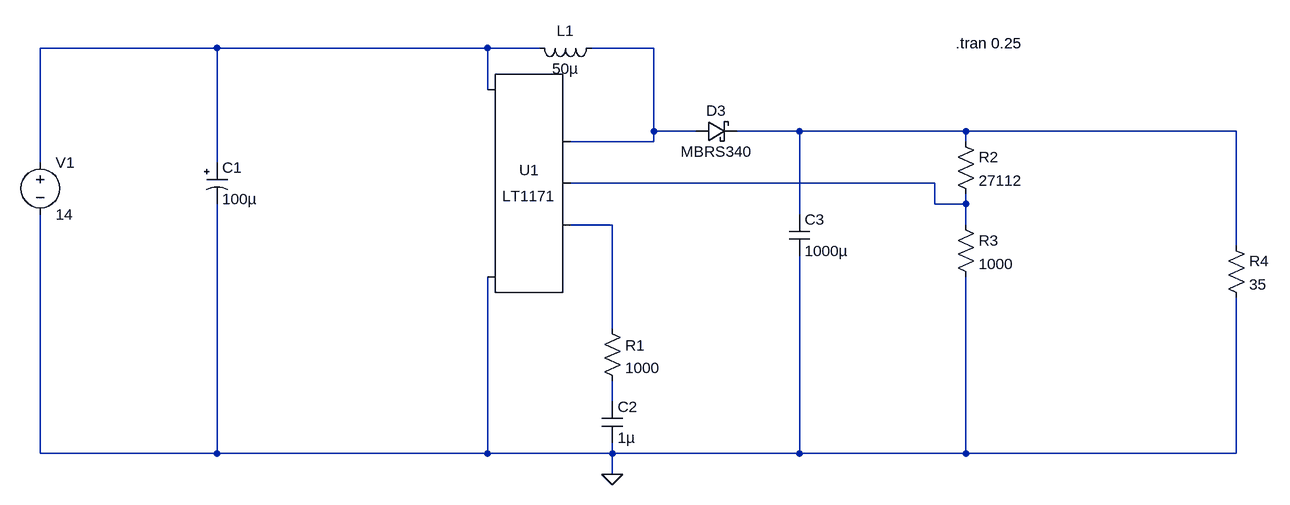
[diagram p0: schematic Simu boost.asc]
Simu boost.asc, the LTspice schematic file:
Version 4
SHEET 1 1396 680
WIRE -240 -16 -512 -16
WIRE 176 -16 -240 -16
WIRE 256 -16 176 -16
WIRE 432 -16 336 -16
WIRE 176 48 176 -16
WIRE 432 112 432 -16
WIRE 496 112 432 112
WIRE 656 112 560 112
WIRE 912 112 656 112
WIRE 1328 112 912 112
WIRE 432 128 432 112
WIRE 432 128 304 128
WIRE 912 128 912 112
WIRE -512 160 -512 -16
WIRE -240 160 -240 -16
WIRE 864 192 304 192
WIRE 864 224 864 192
WIRE 912 224 912 208
WIRE 912 224 864 224
WIRE 656 240 656 112
WIRE 368 256 304 256
WIRE 912 256 912 224
WIRE 1328 288 1328 112
WIRE 368 416 368 256
WIRE 368 528 368 496
WIRE -512 608 -512 240
WIRE -240 608 -240 224
WIRE -240 608 -512 608
WIRE 176 608 176 336
WIRE 176 608 -240 608
WIRE 368 608 368 592
WIRE 368 608 176 608
WIRE 656 608 656 304
WIRE 656 608 368 608
WIRE 912 608 912 336
WIRE 912 608 656 608
WIRE 1328 608 1328 368
WIRE 1328 608 912 608
WIRE 368 640 368 608
FLAG 368 640 0
SYMBOL polcap -256 160 R0
WINDOW 3 24 56 Left 2
SYMATTR Value 100µ
SYMATTR InstName C1
SYMATTR Description Capacitor
SYMATTR Type cap
SYMATTR SpiceLine V=4 Irms=3.72678 Rser=0.018 Lser=0 mfg="KEMET" pn="A700D107M004ATE018" type="Al electrolytic"
SYMBOL cap 352 528 R0
SYMATTR InstName C2
SYMATTR Value 1µ
SYMBOL cap 640 240 R0
SYMATTR InstName C3
SYMATTR Value 1000µ
SYMBOL voltage -512 144 R0
WINDOW 123 0 0 Left 0
WINDOW 39 0 0 Left 0
SYMATTR InstName V1
SYMATTR Value 14
SYMBOL res 352 400 R0
WINDOW 0 36 42 Left 2
SYMATTR InstName R1
SYMATTR Value 1000
SYMBOL schottky 496 128 R270
WINDOW 0 32 32 VTop 2
WINDOW 3 0 32 VBottom 2
SYMATTR InstName D3
SYMATTR Value MBRS340
SYMATTR Description Diode
SYMATTR Type diode
SYMBOL res 896 112 R0
SYMATTR InstName R2
SYMATTR Value 27112
SYMBOL res 896 240 R0
SYMATTR InstName R3
SYMATTR Value 1000
SYMBOL ind 240 -32 M90
WINDOW 0 5 56 VBottom 2
WINDOW 3 32 56 VTop 2
SYMATTR InstName L1
SYMATTR Value 50µ
SYMBOL res 1312 272 R0
SYMATTR InstName R4
SYMATTR Value 35
SYMBOL PowerProducts\\LT1171 176 192 R0
SYMATTR InstName U1
TEXT 896 -24 Left 2 !.tran 0.25

The netlist it stands for:
* Simu boost.asc
C1 N001 0 100µ V=4 Irms=3.72678 Rser=0.018 Lser=0 mfg="KEMET" pn="A700D107M004ATE018" type="Al electrolytic"
C2 N006 0 1µ
C3 N003 0 1000µ
V1 N001 0 14
R1 N005 N006 1000
D3 N002 N003 MBRS340
R2 N003 N004 27112
R3 N004 0 1000
L1 N001 N002 50µ
R4 N003 0 35
XU1 N005 N004 0 N002 N001 LT1171
.model D D
.lib standard.dio
.tran 0.25
.lib LT1171.sub
.backanno
.end